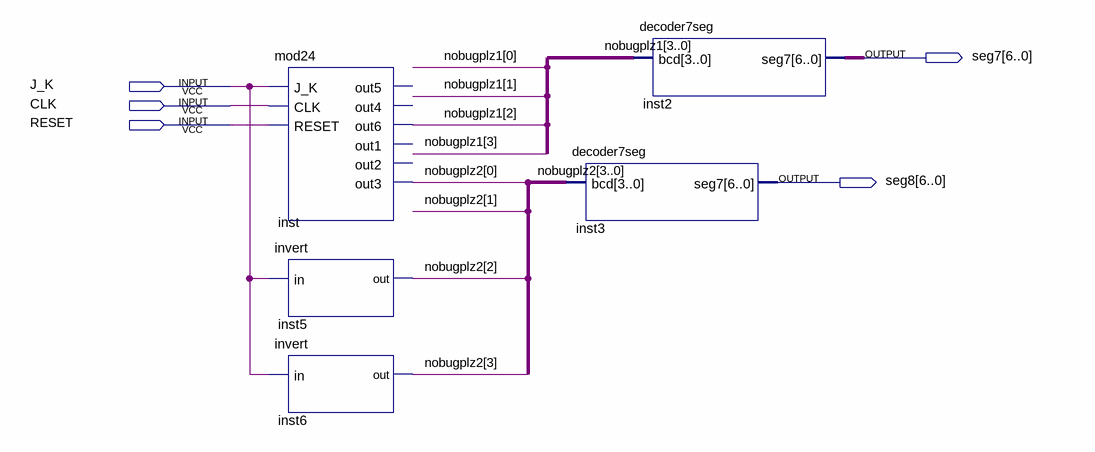
[diagram p0: schematic sheet]
// Quartus schematic test24.bdf as structural Verilog: 5 symbols, 5 pins
module test24 (
  input  J_K,
  input  CLK,
  input  RESET,
  output [6:0] seg7,
  output [6:0] seg8
);

  wire [3:0] nobugplz1, nobugplz2;

  mod24 inst (
    .J_K(J_K), .CLK(CLK), .RESET(RESET), .out6(nobugplz1[2]), .out3(nobugplz2[0]));  // open: out5, out4, out1, out2
  invert inst5 (.in(J_K), .out(nobugplz2[2]));
  invert inst6 (.in(J_K), .out(nobugplz2[3]));
  decoder7seg inst3 (.bcd(nobugplz2), .seg7(seg8));
  decoder7seg inst2 (.bcd(nobugplz1), .seg7(seg7));
endmodule
